# Altium schematic sheet A4.SchDoc
size A4; Organization: Altium Limited; Address1: L3, 12a Rodborough Rd; Address2: Frenchs Forest; Address3: NSW; Address4: Australia 2086
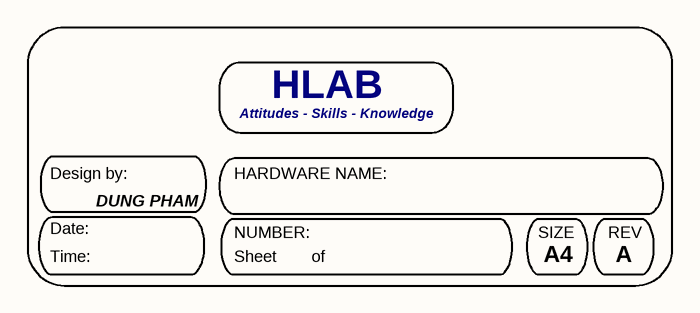
[diagram p0: A4.SchDoc]

## Notes on the sheet
- HLAB
- Design by:
- HARDWARE NAME:
- Attitudes - Skills - Knowledge
- Date:
- Time:
- DUNG PHAM
- NUMBER:
- Sheet
- of
- SIZE
- A4
- REV
- A